# Altium schematic sheet POWER.SchDoc
size 420 x 297 mm; SheetNumber: 5; SheetTotal: 19
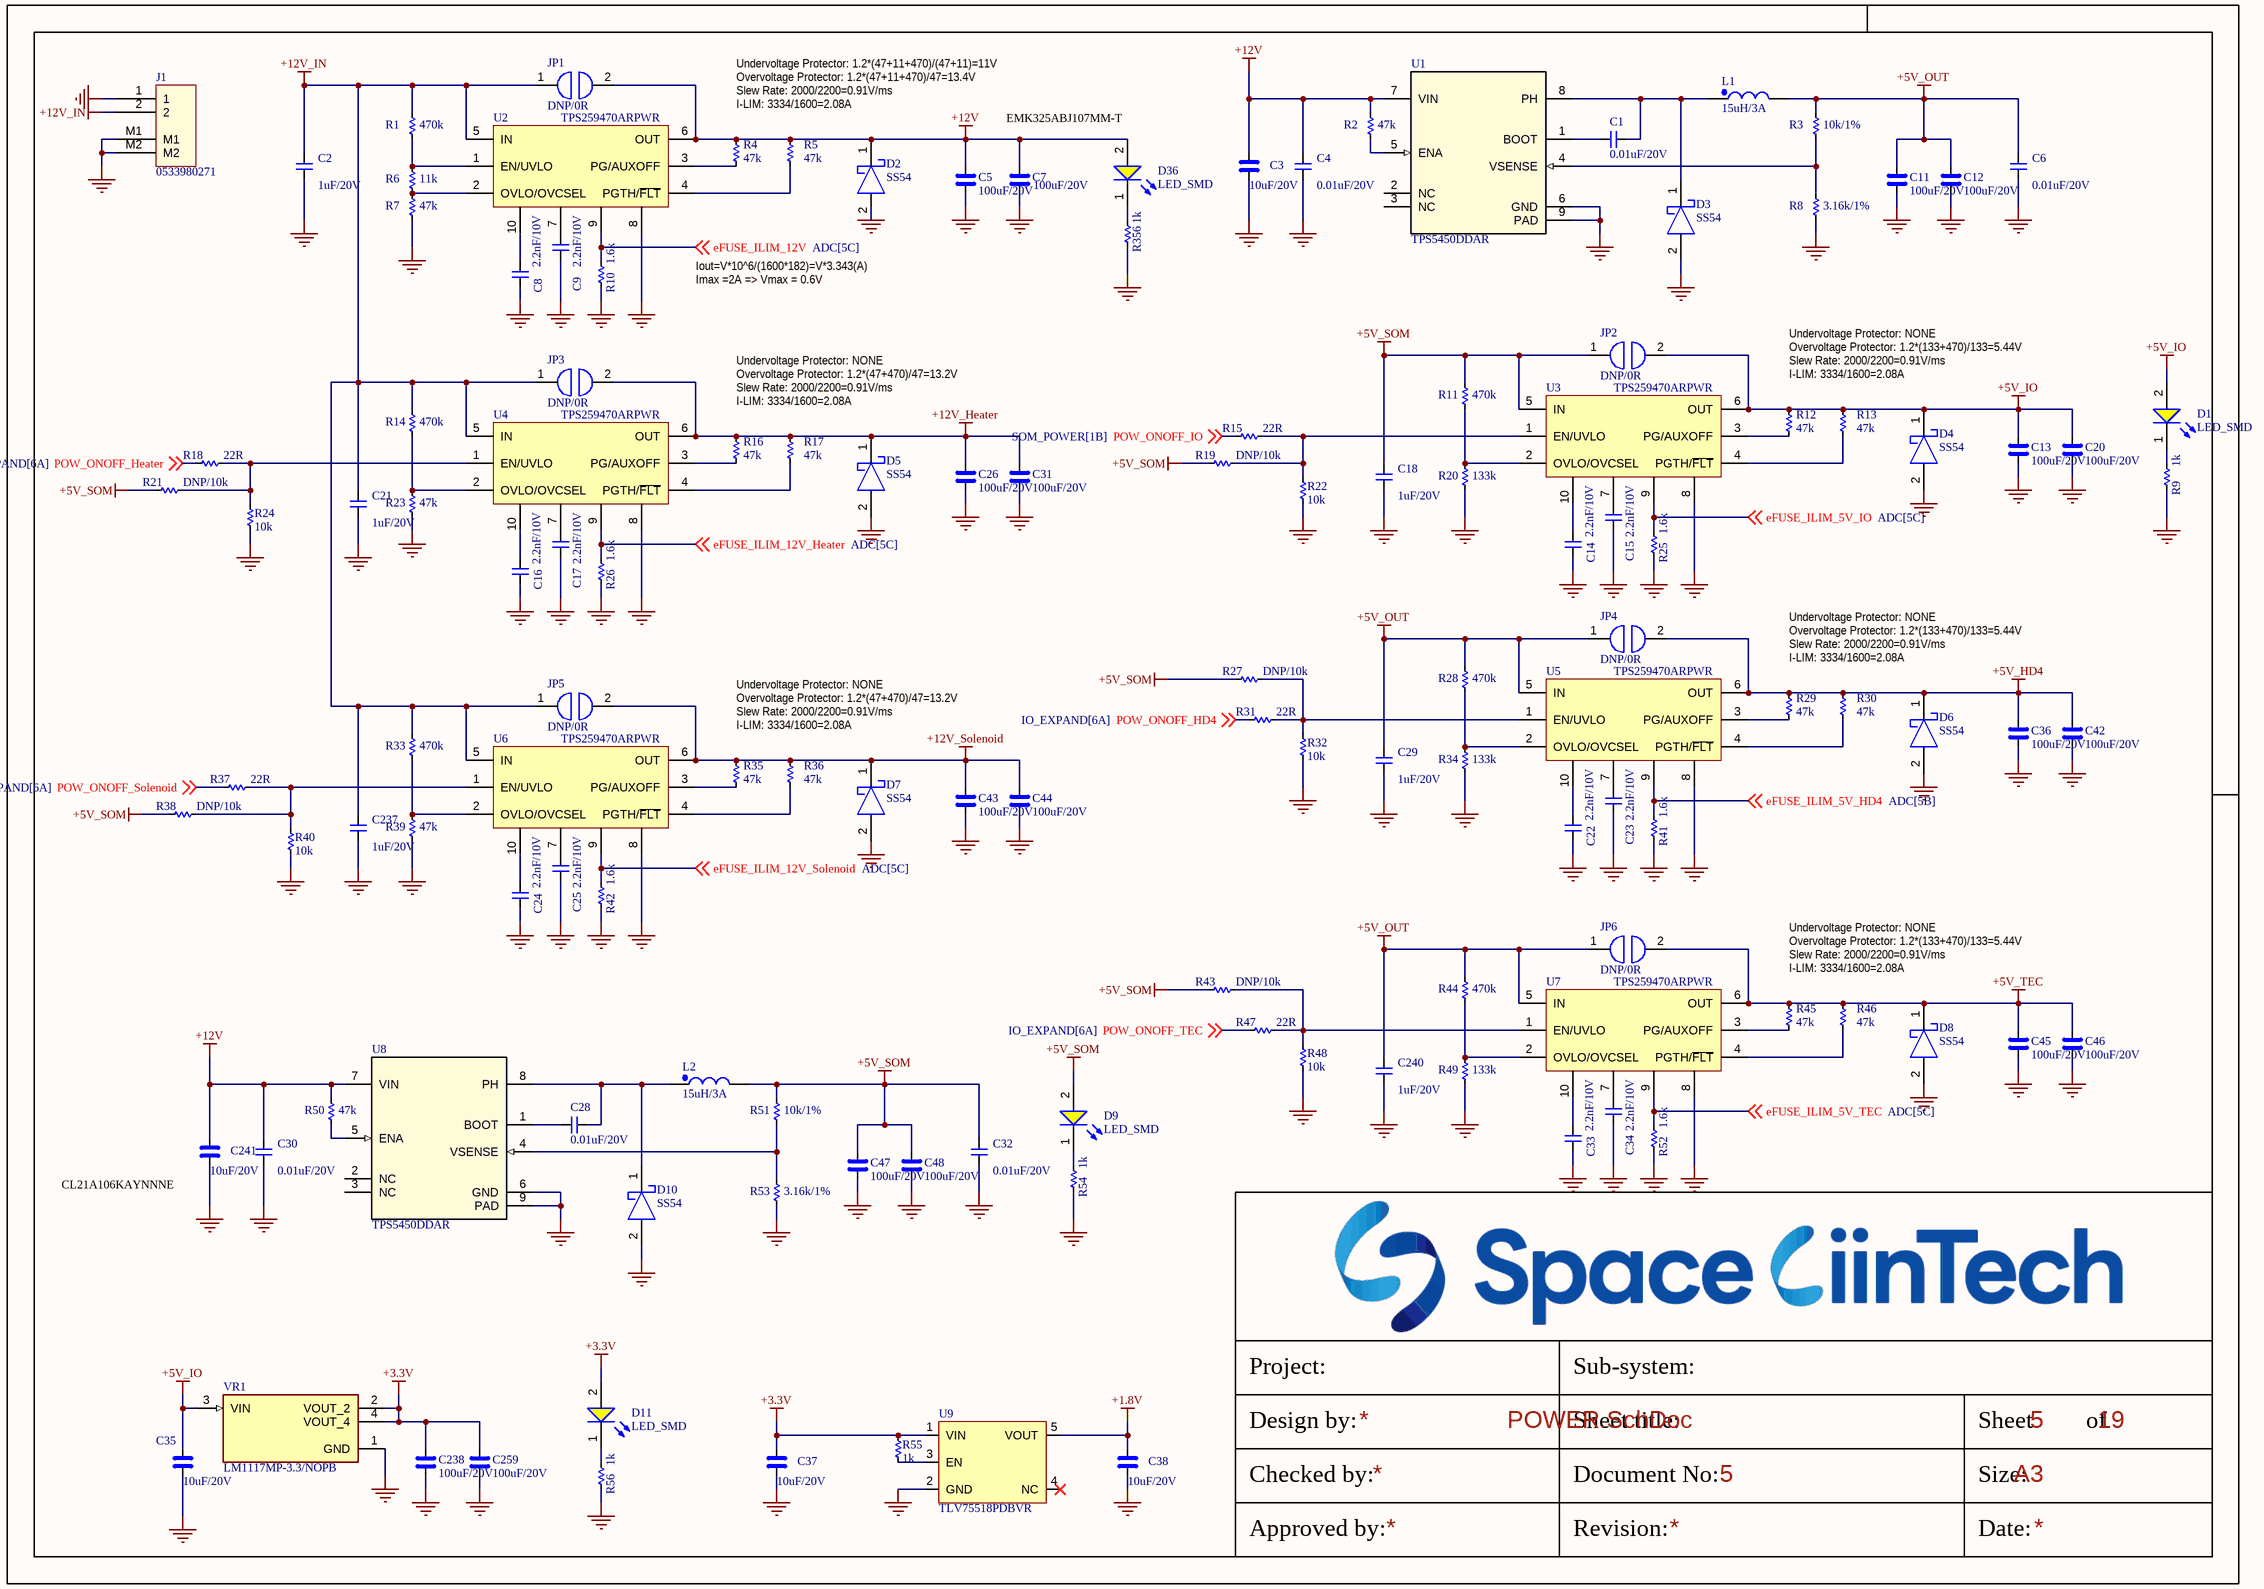
[diagram p0: POWER.SchDoc]

## Parts
C1  0.01uF/20V  [CAP_C_1005X60]
C2  1uF/20V  [CAP_C_1005X60]
C3  10uF/20V  [CAP_C_2012X110]
C4  0.01uF/20V  [CAP_C_1005X60]
C5  100uF/20V  [CAP_C_3225X80]
C6  0.01uF/20V  [CAP_C_1005X60]
C7  100uF/20V  [CAP_C_3225X80]
C8  2.2nF/10V  [CAP_C_1005X60]
C9  2.2nF/10V  [CAP_C_1005X60]
C11  100uF/20V  [CAP_C_3225X80]
C12  100uF/20V  [CAP_C_3225X80]
C13  100uF/20V  [CAP_C_3225X80]
C14  2.2nF/10V  [CAP_C_1005X60]
C15  2.2nF/10V  [CAP_C_1005X60]
C16  2.2nF/10V  [CAP_C_1005X60]
C17  2.2nF/10V  [CAP_C_1005X60]
C18  1uF/20V  [CAP_C_1005X60]
C20  100uF/20V  [CAP_C_3225X80]
C21  1uF/20V  [CAP_C_1005X60]
C22  2.2nF/10V  [CAP_C_1005X60]
C23  2.2nF/10V  [CAP_C_1005X60]
C24  2.2nF/10V  [CAP_C_1005X60]
C25  2.2nF/10V  [CAP_C_1005X60]
C26  100uF/20V  [CAP_C_3225X80]
C28  0.01uF/20V  [CAP_C_1005X60]
C29  1uF/20V  [CAP_C_1005X60]
C30  0.01uF/20V  [CAP_C_1005X60]
C31  100uF/20V  [CAP_C_3225X80]
C32  0.01uF/20V  [CAP_C_1005X60]
C33  2.2nF/10V  [CAP_C_1005X60]
C34  2.2nF/10V  [CAP_C_1005X60]
C35  10uF/20V  [CAP_C_2012X110]
C36  100uF/20V  [CAP_C_3225X80]
C37  10uF/20V  [CAP_C_2012X110]
C38  10uF/20V  [CAP_C_2012X110]
C42  100uF/20V  [CAP_C_3225X80]
C43  100uF/20V  [CAP_C_3225X80]
C44  100uF/20V  [CAP_C_3225X80]
C45  100uF/20V  [CAP_C_3225X80]
C46  100uF/20V  [CAP_C_3225X80]
C47  100uF/20V  [CAP_C_3225X80]
C48  100uF/20V  [CAP_C_3225X80]
C237  1uF/20V  [CAP_C_1005X60]
C238  100uF/20V  [CAP_C_3225X80]
C240  1uF/20V  [CAP_C_1005X60]
C241  10uF/20V  [CAP_C_2012X110]
C259  100uF/20V  [CAP_C_3225X80]
D1  LED_SMD  [LED_0603]
D2  SS54  [DO-214AC_SMA]
D3  SS54  [DO-214AC_SMA]
D4  SS54  [DO-214AC_SMA]
D5  SS54  [DO-214AC_SMA]
D6  SS54  [DO-214AC_SMA]
D7  SS54  [DO-214AC_SMA]
D8  SS54  [DO-214AC_SMA]
D9  LED_SMD  [LED_0603]
D10  SS54  [DO-214AC_SMA]
D11  LED_SMD  [LED_0603]
D36  LED_SMD  [LED_0603]
J1  0533980271  [MOLEX_0533980271]
JP1  DNP/0R  [RES_C_1608X60]
JP2  DNP/0R  [RES_C_1608X60]
JP3  DNP/0R  [RES_C_1608X60]
JP4  DNP/0R  [RES_C_1608X60]
JP5  DNP/0R  [RES_C_1608X60]
JP6  DNP/0R  [RES_C_1608X60]
L1  15uH/3A  [IND730660x480]
L2  15uH/3A  [IND730660x480]
R1  470k  [RES_C_1005X40]
R2  47k  [RES_C_1005X40]
R3  10k/1%  [RES_C_1005X40]
R4  47k  [RES_C_1005X40]
R5  47k  [RES_C_1005X40]
R6  11k  [RES_C_1005X40]
R7  47k  [RES_C_1005X40]
R8  3.16k/1%  [RES_C_1005X40]
R9  1k  [RES_C_1005X40]
R10  1.6k  [RES_C_1005X40]
R11  470k  [RES_C_1005X40]
R12  47k  [RES_C_1005X40]
R13  47k  [RES_C_1005X40]
R14  470k  [RES_C_1005X40]
R15  22R  [RES_C_1005X40]
R16  47k  [RES_C_1005X40]
R17  47k  [RES_C_1005X40]
R18  22R  [RES_C_1005X40]
R19  DNP/10k  [RES_C_1005X40]
R20  133k  [RES_C_1005X40]
R21  DNP/10k  [RES_C_1005X40]
R22  10k  [RES_C_1005X40]
R23  47k  [RES_C_1005X40]
R24  10k  [RES_C_1005X40]
R25  1.6k  [RES_C_1005X40]
R26  1.6k  [RES_C_1005X40]
R27  DNP/10k  [RES_C_1005X40]
R28  470k  [RES_C_1005X40]
R29  47k  [RES_C_1005X40]
R30  47k  [RES_C_1005X40]
R31  22R  [RES_C_1005X40]
R32  10k  [RES_C_1005X40]
R33  470k  [RES_C_1005X40]
R34  133k  [RES_C_1005X40]
R35  47k  [RES_C_1005X40]
R36  47k  [RES_C_1005X40]
R37  22R  [RES_C_1005X40]
R38  DNP/10k  [RES_C_1005X40]
R39  47k  [RES_C_1005X40]
R40  10k  [RES_C_1005X40]
R41  1.6k  [RES_C_1005X40]
R42  1.6k  [RES_C_1005X40]
R43  DNP/10k  [RES_C_1005X40]
R44  470k  [RES_C_1005X40]
R45  47k  [RES_C_1005X40]
R46  47k  [RES_C_1005X40]
R47  22R  [RES_C_1005X40]
R48  10k  [RES_C_1005X40]
R49  133k  [RES_C_1005X40]
R50  47k  [RES_C_1005X40]
R51  10k/1%  [RES_C_1005X40]
R52  1.6k  [RES_C_1005X40]
R53  3.16k/1%  [RES_C_1005X40]
R54  1k  [RES_C_1005X40]
R55  1k  [RES_C_1005X40]
R56  1k  [RES_C_1005X40]
R356  1k  [RES_C_1005X40]
U1  TPS5450DDAR  [DDA0008J]
U2  TPS259470ARPWR  [VQFN-HR-10]
U3  TPS259470ARPWR  [VQFN-HR-10]
U4  TPS259470ARPWR  [VQFN-HR-10]
U5  TPS259470ARPWR  [VQFN-HR-10]
U6  TPS259470ARPWR  [VQFN-HR-10]
U7  TPS259470ARPWR  [VQFN-HR-10]
U8  TPS5450DDAR  [DDA0008J]
U9  TLV75518PDBVR  [SOT25]
VR1  LM1117MP-3.3/NOPB  [VREG_LM1117MP-3.3/NOPB]

## Nets
+1.8V: C38.1 U9.5(VOUT)
+3.3V: C37.1 C238.2 C259.2 D11.2(A) R55.2 U9.1(VIN) VR1.2(VOUT_2) VR1.4(VOUT_4)
+5V_HD4: C36.2 C42.2 D6.1 JP4.2 R29.2 R30.2 U5.6(OUT)
+5V_IO: C13.2 C20.2 C35.1 D1.2(A) D4.1 JP2.2 R12.2 R13.2 U3.6(OUT) VR1.3(VIN)
+5V_OUT: C6.2 C11.2 C12.2 C29.2 C240.2 JP4.1 JP6.1 L1.2 R3.2 R28.2 R44.2 U5.5(IN) U7.5(IN)
+5V_SOM: C18.2 C32.2 C47.2 C48.2 D9.2(A) JP2.1 L2.2 R11.2 R19.2 R21.2 R27.2 R38.2 R43.2 R51.2 U3.5(IN)
+5V_TEC: C45.2 C46.2 D8.1 JP6.2 R45.2 R46.2 U7.6(OUT)
+12V: C3.1 C4.2 C5.2 C7.2 C30.2 C241.1 D2.1 D36.2(A) JP1.2 R2.2 R4.2 R5.2 R50.2 U1.7(VIN) U2.6(OUT) U8.7(VIN)
+12V_Heater: C26.2 C31.2 D5.1 JP3.2 R16.2 R17.2 U4.6(OUT)
+12V_IN: C2.2 C21.2 C237.2 J1.2 JP1.1 JP3.1 JP5.1 R1.2 R14.2 R33.2 U2.5(IN) U4.5(IN) U6.5(IN)
+12V_Solenoid: C43.2 C44.2 D7.1 JP5.2 R35.2 R36.2 U6.6(OUT)
GND: C2.1 C3.2 C4.1 C5.1 C6.1 C7.1 C8.1 C9.1 C11.1 C12.1 C13.1 C14.1 C15.1 C16.1 C17.1 C18.1 C20.1 C21.1 C22.1 C23.1 C24.1 C25.1 C26.1 C29.1 C30.1 C31.1 C32.1 C33.1 C34.1 C35.2 C36.1 C37.2 C38.2 C42.1 C43.1 C44.1 C45.1 C46.1 C47.1 C48.1 C237.1 C238.1 C240.1 C241.2 C259.1 D2.2 D3.2 D4.2 D5.2 D6.2 D7.2 D8.2 D10.2 J1.1 J1.M1 J1.M2 R7.1 R8.1 R9.1 R10.1 R20.1 R22.2 R23.1 R24.2 R25.1 R26.1 R32.2 R34.1 R39.1 R40.2 R41.1 R42.1 R48.2 R49.1 R52.1 R53.1 R54.1 R56.1 R356.1 U1.6(GND) U1.9(PAD) U2.8 U3.8 U4.8 U5.8 U6.8 U7.8 U8.6(GND) U8.9(PAD) U9.2(GND) VR1.1(GND)
eFUSE_ILIM_5V_HD4: R41.2 U5.9 ; off-sheet eFUSE_ILIM_5V_HD4
eFUSE_ILIM_5V_IO: R25.2 U3.9 ; off-sheet eFUSE_ILIM_5V_IO
eFUSE_ILIM_5V_TEC: R52.2 U7.9 ; off-sheet eFUSE_ILIM_5V_TEC
eFUSE_ILIM_12V: R10.2 U2.9 ; off-sheet eFUSE_ILIM_12V
eFUSE_ILIM_12V_Heater: R26.2 U4.9 ; off-sheet eFUSE_ILIM_12V_Heater
eFUSE_ILIM_12V_Solenoid: R42.2 U6.9 ; off-sheet eFUSE_ILIM_12V_Solenoid
POW_ONOFF_HD4: R31.2 ; off-sheet POW_ONOFF_HD4
POW_ONOFF_Heater: R18.2 ; off-sheet POW_ONOFF_Heater
POW_ONOFF_IO: R15.2 ; off-sheet POW_ONOFF_IO
POW_ONOFF_Solenoid: R37.2 ; off-sheet POW_ONOFF_Solenoid
POW_ONOFF_TEC: R47.2 ; off-sheet POW_ONOFF_TEC
NetC1_1: C1.1 D3.1 L1.1 U1.8(PH)
NetC1_2: C1.2 U1.1(BOOT)
NetC8_2: C8.2 U2.10
NetC9_2: C9.2 U2.7
NetC14_2: C14.2 U3.10
NetC15_2: C15.2 U3.7
NetC16_2: C16.2 U4.10
NetC17_2: C17.2 U4.7
NetC22_2: C22.2 U5.10
NetC23_2: C23.2 U5.7
NetC24_2: C24.2 U6.10
NetC25_2: C25.2 U6.7
NetC28_1: C28.1 D10.1 L2.1 U8.8(PH)
NetC28_2: C28.2 U8.1(BOOT)
NetC33_2: C33.2 U7.10
NetC34_2: C34.2 U7.7
NetD1_1: D1.1(K) R9.2
NetD9_1: D9.1(K) R54.2
NetD11_1: D11.1(K) R56.2
NetD36_1: D36.1(K) R356.2
NetR1_1: R1.1 R6.2 U2.1(EN/UVLO)
NetR2_1: R2.1 U1.5(ENA)
NetR3_1: R3.1 R8.2 U1.4(VSENSE)
NetR4_1: R4.1 U2.3(PG/AUXOFF)
NetR5_1: R5.1 U2.4(PGTH/~{FLT})
NetR6_1: R6.1 R7.2 U2.2(OVLO/OVCSEL)
NetR11_1: R11.1 R20.2 U3.2(OVLO/OVCSEL)
NetR12_1: R12.1 U3.3(PG/AUXOFF)
NetR13_1: R13.1 U3.4(PGTH/~{FLT})
NetR14_1: R14.1 R23.2 U4.2(OVLO/OVCSEL)
NetR15_1: R15.1 R19.1 R22.1 U3.1(EN/UVLO)
NetR16_1: R16.1 U4.3(PG/AUXOFF)
NetR17_1: R17.1 U4.4(PGTH/~{FLT})
NetR18_1: R18.1 R21.1 R24.1 U4.1(EN/UVLO)
NetR27_1: R27.1 R31.1 R32.1 U5.1(EN/UVLO)
NetR28_1: R28.1 R34.2 U5.2(OVLO/OVCSEL)
NetR29_1: R29.1 U5.3(PG/AUXOFF)
NetR30_1: R30.1 U5.4(PGTH/~{FLT})
NetR33_1: R33.1 R39.2 U6.2(OVLO/OVCSEL)
NetR35_1: R35.1 U6.3(PG/AUXOFF)
NetR36_1: R36.1 U6.4(PGTH/~{FLT})
NetR37_1: R37.1 R38.1 R40.1 U6.1(EN/UVLO)
NetR43_1: R43.1 R47.1 R48.1 U7.1(EN/UVLO)
NetR44_1: R44.1 R49.2 U7.2(OVLO/OVCSEL)
NetR45_1: R45.1 U7.3(PG/AUXOFF)
NetR46_1: R46.1 U7.4(PGTH/~{FLT})
NetR50_1: R50.1 U8.5(ENA)
NetR51_1: R51.1 R53.2 U8.4(VSENSE)
NetR55_1: R55.1 U9.3(EN)

Not connected (* = marked no-connect by the designer): U1 2(NC) 3(NC); U8 2(NC) 3(NC); U9 4(NC)*

## Notes on the sheet
- Undervoltage Protector: 1.2*(47+11+470)/(47+11)=11V
- Overvoltage Protector: 1.2*(47+11+470)/47=13.4V
- Slew Rate: 2000/2200=0.91V/ms
- I-LIM: 3334/1600=2.08A
- EMK325ABJ107MM-T
- Iout=V*10^6/(1600*182)=V*3.343(A)
- Imax =2A => Vmax = 0.6V
- Undervoltage Protector: NONE
- Overvoltage Protector: 1.2*(47+470)/47=13.2V
- Overvoltage Protector: 1.2*(133+470)/133=5.44V
- (near C241) CL21A106KAYNNNE
- Project:
- Sub-system:
- Design by:
- Sheet title:
- Sheet
- of
- Checked by:
- Approved by:
- Revision:
- Document No:
- Size:
- Date:
- A3

## Library data of the parts
C1 C2 C4 C6 C8 C9 C14-C18 C21-C25 C28-C30 C32-C34 C237 C240 = _CAP_C_2: CAP CHIP
C3 C5 C7 C11-C13 C20 C26 C31 C35-C38 C42-C48 C238 C241 C259 = _CAP_C_High_2: CAP CHIP High Value
D2-D8 D10 = SS54: DIODE SCHOTTKY 60V 3A DO214AA
J1 = Header 2x1_2M
JP1-JP6 = JUMPER
L1 L2 = _IND: SRP7050TA-100M
R1-R56 R356 = _RES_B_2: RES
U1 U8 = TPS5430DDAR: No Description Available; Mfr_Name: Texas Instruments; TYPE: TYPE; RefDes: RefDes
U9 = IC_POWER_AP7347DQ
VR1 = LM1117MP-3.3/NOPB: 800-mA 15-V linear voltage regulator; MF: Texas Instruments; SnapEDA_Link: https://www.snapeda.com/parts/LM1117MP-3.3/NOPB/Texas+Instruments/view-part/?ref=snap; Package: SOT-223-4 Texas Instruments; Value: *; MP: LM1117MP-3.3/NOPB; Check_prices: https://www.snapeda.com/parts/LM1117MP-3.3/NOPB/Texas+Instruments/view-part/?ref=eda